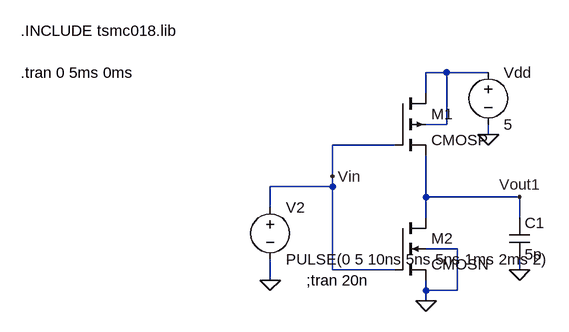
[diagram p0: schematic d.asc]
d.asc, the LTspice schematic file:
Version 4
SHEET 1 1364 680
WIRE 512 64 480 64
WIRE 576 64 512 64
WIRE 480 96 480 64
WIRE 512 144 512 64
WIRE 512 144 480 144
WIRE 576 160 576 144
WIRE 432 176 336 176
WIRE 336 224 336 176
WIRE 336 240 336 224
WIRE 336 240 240 240
WIRE 480 256 480 192
WIRE 624 256 480 256
WIRE 240 272 240 240
WIRE 480 288 480 256
WIRE 624 288 624 256
WIRE 528 336 480 336
WIRE 336 368 336 240
WIRE 432 368 336 368
WIRE 624 368 624 352
WIRE 240 384 240 352
WIRE 480 400 480 384
WIRE 528 400 528 336
WIRE 528 400 480 400
WIRE 480 416 480 400
FLAG 480 416 0
FLAG 576 160 0
FLAG 240 384 0
FLAG 624 368 0
FLAG 336 224 Vin
FLAG 624 256 Vout1
SYMBOL cmosp 432 96 R0
SYMATTR InstName M1
SYMATTR Value2 l=180n w=800n
SYMBOL cmosn 432 288 R0
SYMATTR InstName M2
SYMATTR Value2 l=180n w=400n
SYMBOL voltage 576 48 R0
SYMATTR InstName Vdd
SYMATTR Value 5
SYMBOL voltage 240 256 R0
WINDOW 123 0 0 Left 0
WINDOW 39 0 0 Left 0
SYMATTR InstName V2
SYMATTR Value PULSE(0 5 10ns 5ns 5ns 1ms 2ms 2)
SYMBOL cap 608 288 R0
SYMATTR InstName C1
SYMATTR Value 5p
TEXT -144 0 Left 2 !.INCLUDE tsmc018.lib
TEXT -144 64 Left 2 !.tran 0 5ms 0ms
TEXT 296 384 Left 2 !;tran 20n

The netlist it stands for:
* d.asc
M1 N001 Vin Vout1 N001 CMOSP l=180n w=800n
M2 Vout1 Vin 0 0 CMOSN l=180n w=400n
Vdd N001 0 5
V2 Vin 0 PULSE(0 5 10ns 5ns 5ns 1ms 2ms 2)
C1 Vout1 0 5p
.model NMOS NMOS
.model PMOS PMOS
.lib standard.mos
.INCLUDE tsmc018.lib
.tran 0 5ms 0ms
;tran 20n
.backanno
.end